# Altium project PCB_Project.PrjPcb
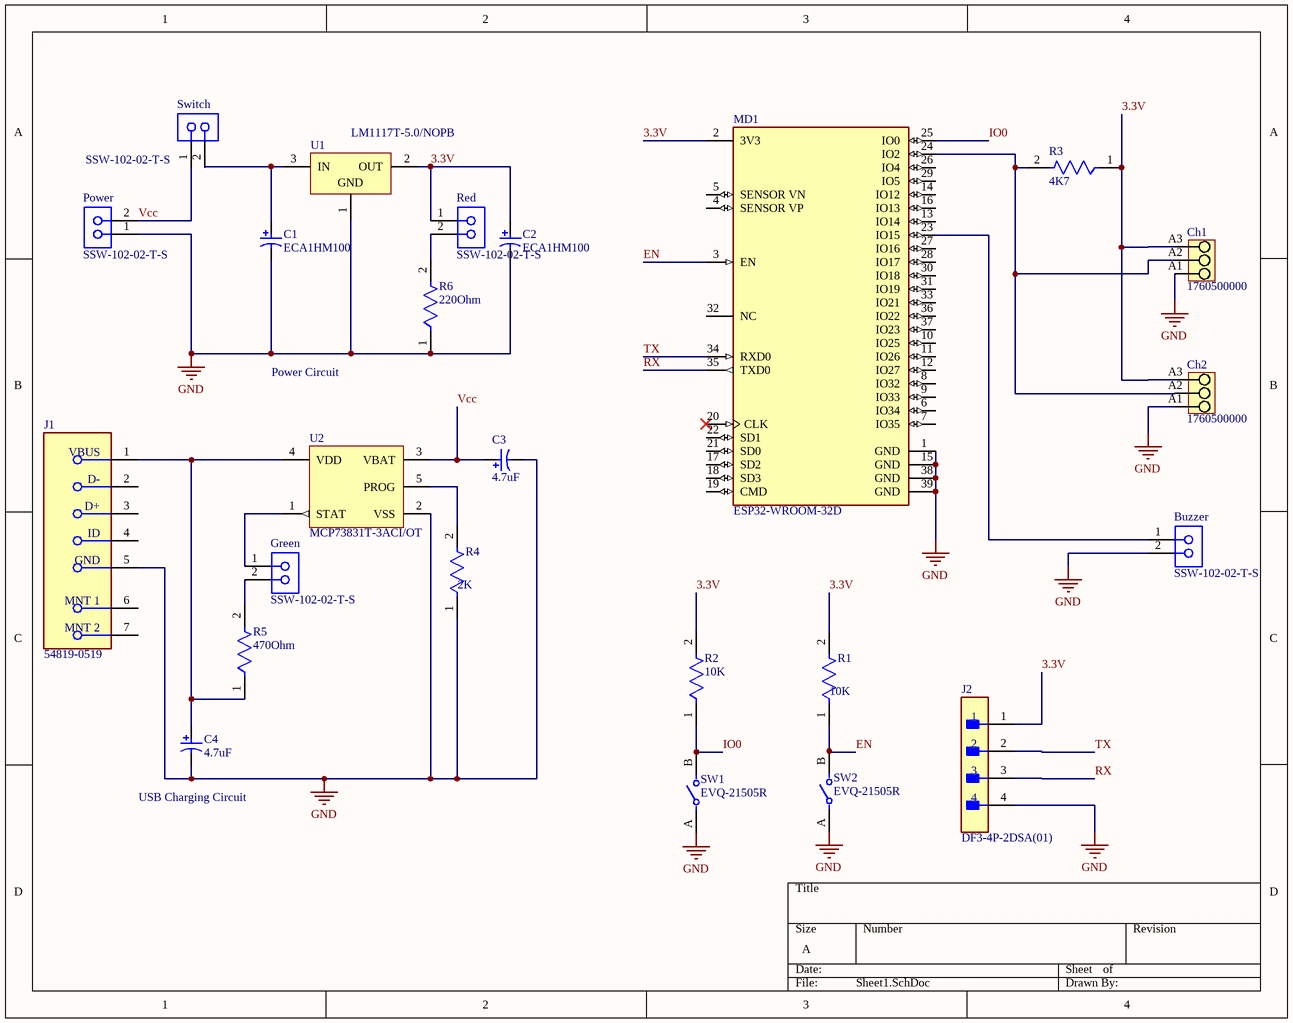
[diagram p0: Sheet1.SchDoc]
1 sheet, 24 parts. Net scope: global (net labels, ports and power ports of the same name join across sheets).
Board file: PCB1.PcbDoc

## Sheet Sheet1.SchDoc
size A; SheetNumber: 1; SheetTotal: 1

### Parts
Buzzer  SSW-102-02-T-S  [SMTC-SSW-102-02-X-S]
C1  ECA1HM100  [CAPPR55-200-1100X500X1200]
C2  ECA1HM100  [CAPPR55-200-1100X500X1200]
C3  4.7uF  [CAPPR55-200-1100X500X1200]
C4  4.7uF  [CAPPR55-200-1100X500X1200]
Ch1  1760500000  [PM_5_08_90_03]
Ch2  1760500000  [PM_5_08_90_03]
Green  SSW-102-02-T-S  [SMTC-SSW-102-02-X-S]
J1  54819-0519  [FP-54819-0519-MFG]
J2  DF3-4P-2DSA(01)  [FP-DF3-4P-2DSA_01-MFG]
MD1  ESP32-WROOM-32D  [FP-ESP32-WROOM-32D-MFG]
Power  SSW-102-02-T-S  [SMTC-SSW-102-02-X-S]
R1  10K  [FP-CF18-MFG]
R2  10K  [FP-CF18-MFG]
R3  4K7  [FP-CF18-MFG]
R4  2K  [FP-CF18-MFG]
R5  470Ohm  [FP-CF18-MFG]
R6  220Ohm  [FP-CF18-MFG]
Red  SSW-102-02-T-S  [SMTC-SSW-102-02-X-S]
SW1  EVQ-21505R  [FP-EVQ-21505R-MFG]
SW2  EVQ-21505R  [FP-EVQ-21505R-MFG]
Switch  SSW-102-02-T-S  [SMTC-SSW-102-02-X-S]
U1  LM1117T-5.0/NOPB  [NDE0003A]
U2  MCP73831T-3ACI/OT  [SOT-23-OT5_M]

### Nets
GND: Buzzer.2 C1.2 C2.2 C3.2 C4.2 Ch1.A1 Ch2.A1 J1.5(GND) J2.4 MD1.1(GND) MD1.15(GND) MD1.38(GND) MD1.39(GND) Power.1 R4.1 R6.1 SW1.A SW2.A U1.1(GND) U2.2(VSS)
3.3V: C2.1 Ch1.A3 Ch2.A3 J2.1 MD1.2(3V3) R1.2 R2.2 R3.1 Red.1 U1.2(OUT)
EN: MD1.3(EN) R1.1 SW2.B
IO0: MD1.25(IO0) R2.1 SW1.B
RX: J2.3 MD1.35(TXD0)
TX: J2.2 MD1.34(RXD0)
Vcc: C3.1 Power.2 Switch.1 U2.3(VBAT)
NetBuzzer_1: Buzzer.1 MD1.23(IO15)
NetC1_1: C1.1 Switch.2 U1.3(IN)
NetC4_1: C4.1 J1.1(VBUS) R5.1 U2.4(VDD)
NetCh1_A2: Ch1.A2 Ch2.A2 MD1.24(IO2) R3.2
NetGreen_1: Green.1 U2.1(STAT)
NetGreen_2: Green.2 R5.2
NetR4_2: R4.2 U2.5(PROG)
NetR6_2: R6.2 Red.2

Not connected (* = marked no-connect by the designer): J1 2(D-) 3(D+) 4(ID) 6(MNT_1) 7(MNT_2); MD1 4(SENSOR_VP) 5(SENSOR_VN) 6(IO34) 7(IO35) 8(IO32) 9(IO33) 10(IO25) 11(IO26) 12(IO27) 13(IO14) 14(IO12) 16(IO13) 17(SD2) 18(SD3) 19(CMD) 20(CLK)* 21(SD0) 22(SD1) 26(IO4) 27(IO16) 28(IO17) 29(IO5) 30(IO18) 31(IO19) 32(NC) 33(IO21) 36(IO22) 37(IO23)

### Notes on the sheet
- Power Circuit
- (near C4) USB Charging Circuit

### Library data of the parts
Buzzer Green Power Red Switch = CMP-1023-00323-1: SQ Post Socket, Through-hole, Vertical, -55 to 105 degC, 2.54 mm Pitch, 2-Pin, Female, RoHS; Manufacturer: Samtec; Pitch: 2.54 mm; ComponentLink3Description: Package Specification; ComponentLink2Description: Datasheet; ComponentLink1Description: Manufacturer URL; PackageVersion: CA, 6/1987; DatasheetVersion: F-214; PackageDescription: Assembly, Socket Strip .016 X .031 Tail; ComponentLink2URL: http://www.samtec.com/documents/webfiles/pdf/SSW_TH.PDF; RoHS: True; ComponentLink3URL: http://www.samtec.com/documents/webfiles/cpdf/SSW-1XX-XX-XXX-X-XX-XXX-XX-MKT.pdf; ComponentLink1URL: http://www.samtec.com; PackageReference: SSW-102-02-X-S; Mounting Technology: Through-hole; Orientation: Vertical; Temperature Range: -55 to 105 degC; PartNumber: SSW-102-02-T-S
C1 C2 = CMP-1665-00038-2: Aluminum Electrolytic Capacitor, 10 uF, +/- 20%, 50 V, -40 to 85 degC, 2-Pin THD, RoHS, Bulk; Manufacturer: Panasonic; Life (Hours): 2000Hour; Lead/Base Style: Straight; Dissipation Factor: 0.12%; Capacitance: 10uF; Leakage Current: 3uA; Dielectric Material: Aluminium; Lead Diameter: 0.5mm; Voltage Rating: 50V; Ripple Current: 65mA; Package Reference: CAPPR55-200-1100X500X1200; Height: 11mm; Diameter: 5mm; REACH SVHC: NoSVHC; Mount: ThroughHole; Packaging: Bulk; Manufacturer URL: http://www.panasonic.com/; Termination: Radial; Datasheet URL: https://industrial.panasonic.com/cdbs/www-data/pdf/RDF0000/ABA0000C1218.pdf; Lead Free: LeadFree; Height - Seated (Max): 0.472inch; Case/Package: Radial; Package Description: 2-Pin Radial Lead, Dia 5 mm, Height 12 mm; Tolerance: 20%; Datasheet Version: Rev. 05, 10/2016; Package Quantity: 200; Ripple Current (AC): 65mA; Min Operating Temperature: -40degC; RoHSCompliant: true; Number of Pins: 2; Max Operating Temperature: 85degC; Voltage: 50V; Lead Pitch: 2mm; Radiation Hardening: No; Voltage Rating (DC): 50V; Length: 11mm
C3 C4 = CMP-1665-00037-2: Aluminum Electrolytic Capacitor, 4.7 uF, +/- 20%, 50 V, -40 to 85 degC, 2-Pin THD, RoHS, Bulk; Manufacturer: Panasonic; Life (Hours): 2000Hour; Dielectric Material: Aluminium; Voltage Rating: 50V; Leakage Current: 3uA; Ripple Current: 45mA; Lead/Base Style: Straight; Dissipation Factor: 0.12%; Lead Diameter: 0.5mm; Package Description: 2-Pin Radial Lead, Dia 5 mm, Height 12 mm; REACH SVHC: NoSVHC; RoHSCompliant: true; Height: 11mm; Package Reference: CAPPR55-200-1100X500X1200; Datasheet URL: https://industrial.panasonic.com/cdbs/www-data/pdf/RDF0000/ABA0000C1218.pdf; Lead Pitch: 2mm; Diameter: 5mm; Voltage Rating (DC): 50V; Voltage: 50V; Termination: Radial; Min Operating Temperature: -40degC; Package Quantity: 200; Max Operating Temperature: 85degC; Length: 11mm; Mount: ThroughHole; Number of Pins: 2; Lead Free: LeadFree; Ripple Current (AC): 45mA; Datasheet Version: Rev. 05, 10/2016; Width: 0inch; Capacitance: 4.7uF; Case/Package: Radial; Tolerance: 20%; Manufacturer URL: http://www.panasonic.com/; Height - Seated (Max): 0.472inch; Packaging: Bulk; Radiation Hardening: No
Ch1 Ch2 = CMP-1559-01629-1: OMNIMATE Signal - series PM; Manufacturer: Weidmueller; Pitch_mm: 5,08 mm; Pitch_inch: 0,2 inch; Wire_cross_section_AWG_min_UL_1059: AWG 26; Contact_surface: tinned; Contact_material: Cu-Leg; Short_text_for_material: PM 5.08/03/90 3.5SN OR BX; Rated_voltage_use_group_B_UL_1059: 300 V; Solid_min_H05_07_V_U: 0,13 mm²; Solder_pin_length_mm: 3,5 mm; Rated_voltage_for_surge_voltage_class_pollution_degree_II_2: 600 V; Mounting_onto_the_PCB: Solder connection; Solid_max_H05_07_V_U: 2,5 mm²; Side_termination_characteristic: closed side; Rated_current_use_group_B_UL_1059: 15 A; Wire_cross_section_AWG_max_UL_1059: AWG 14; Insulating_material: Wemid (PA); UL_94_flammability_rating: V-0; No_of_poles: 3; ComponentLink2Description: URL Link1; ComponentLink1Description: Manufacturer URL; PartNumber: 1760500000; ComponentLink2URL: http://catalog.weidmueller.com/catalog/Start.do?localeId=en&ObjectID=1760500000; ComponentLink1URL: http://www.weidmueller.com/; Qty: 500 PCS; Colour: Orange; Packaging: Box; Revision: V1; PackageReference: PM_5_08_90_03
J1 = CMP-04767-000009-1: CONN RCPT USB2.0 MINI B 5P R/A; Number of Circuits: 5; Max Current Rating: 1A; Pitch: 0.8mm; Contact Resistance: 50mR; Data Rate: 480Mbps; Gender: Receptacle; Number of Ports: 1; Connector Type: USB; Working Voltage: 30V; Insulation Resistance: 100MR; Number of Rows: 1; Series: 54819; USB Standard: USB 2.0; Contact Plating: Gold; Min Operating Temperature: 0°C; Radiation Hardening: No; Current Rating: 1A; Number of Terminals/Pins: 5; Number of Positions: 5; Packaging: Tray; Termination: Solder; Orientation: Right Angle; Flammability Rating: UL94 V-0; Package Quantity: 3600; Number of Contacts: 5; Lead Free: Lead Free; Max Operating Temperature: 50°C; Color: Black; Housing Color: Black; Contact Material: Copper Alloy; Width: 6.9mm; Length: 7.7mm; Housing Material: Polyamide; Features: Shielded; Mount: Through Hole; Voltage Rating: 30V; Depth: 9mm; Voltage Rating (DC): 30V
J2 = CMP-11610-000023-1: CONN HEADER VERT 4POS 2MM; Connector Type: Male Pin; Voltage Rating: 100V; Max Current Rating: 3A; Number of Positions: 4; Gender: Male; Contact Resistance: 30mR; Lead Free: Lead Free; Contact Type: Male Pin; RoHS Compliant: Yes; Pitch: 2mm; Housing Material: Polyamide; Contact Gender: Male; Mount: Through Hole; Series: DF3; Housing Color: Black; Contact Plating: Gold; Package Quantity: 100; Orientation: Straight; Color: Black; Number of Rows: 1; Packaging: Bag; Depth: 5mm; Contact Material: Brass; Height: 5mm; Termination: Press-Fit; Number of Contacts: 4; Current Rating: 3A; Max Operating Temperature: 85°C; REACH SVHC: No SVHC; Length: 10mm; Min Operating Temperature: -30°C; Max Voltage Rating (AC): 100V
MD1 = CMP-194065-000003-1: WIFI MODULE 32MBITS SPI FLASH; Manufacturer: Espressif Systems; Max Supply Voltage: 3.6V; Nominal Supply Current: 500mA; Max Frequency: 2484MHz; Number Of Adc Channels: 16; Number Of Gpio: 32; Interface: I2C,SPI,UART,Ethernet,I2S,Other; Data Rate: 150Mbits/s; Min Supply Voltage: 3V; Bandwidth: 72MHz; Sensitivity: -98dBm; Octopart: https://octopart.com/esp32-wroom-32d-espressif+systems-91040050; Package: ESP32-WROOM-32D; ComponentLink2URL: https://www.espressif.com/sites/default/files/documentation/esp32-wroom-32d_esp32-wroom-32u_datasheet_en.pdf; Lead Free: Yes; Category: UNK; Mouser Description: Wi-Fi/BT BLE Module ESP32-D0WD, SPI Flash, UART, P; Device Class L1: Integrated Circuits (ICs); RoHS: TRUE; Temperature Range Low: -40°C; ComponentLink2Description: Datasheet; Digikey Description: WIFI MODULE 32MBITS SPI FLASH; Height: 3.2mm; Temperature: -40°C to +85°C; Manufacturer Part Number: ESP32-WROOM-32D; Device Class L3: Transceivers; Device Class L2: RF Semiconductors and Devices; Temperature Range High: +85°C; Automotive: No
R1-R6 = CMP-26528-000002-1: RES 10K OHM 1/8W 5% CF AXIAL; Manufacturer Part Number: CF18JT10K0; Manufacturer: Stackpole Electronics; Power Rating: 0.125W; Temperature Coefficient: 0-500ppm/°C; Resistance: 10kΩ; Voltage Rating: 250V; Value: 10kΩ; Temperature: -55°C to +155°C; Height: 2mm; Lead Free: Yes; Automotive: No; Device Class L2: Resistors; Package: CF18; Series: CF; ComponentLink2Description: Datasheet; Ipc Land Pattern Name: RESAD656W65L360D200; Temperature Range High: +155°C; RoHS: TRUE; Device Class L3: Through-Hole Resistors; Temperature Range Low: -55°C; Device Class L1: Passive Components; Category: Res; Octopart: https://octopart.com/cf18jt10k0-stackpole+electronics-19205642; Composition: Carbon Film; Digikey Description: RES 10K OHM 1/8W 5% CF AXIAL; ComponentLink2URL: http://www.seielect.com/Catalog/SEI-CF_CFM.pdf; Tolerance: 5%
SW1 SW2 = CMP-05618-000118-1: SWITCH TACTILE SPST-NO 0.02A 15V; Actuator Length: 1.6mm; Contact Current Rating: 20mA; Actuator Type: Standard; Operating Force: 1.6N; Switch Function: Off-Mom; Mechanical Life: 100000Cycles; Illumination Type: Non-Illuminated; Contact Resistance: 50mR; Actuator Color: Red; Throw Configuration: SPST; Switch Travel: 0.25mm; Termination: PC Pin; Package Quantity: 1; Lead Free: Lead Free; Orientation: Straight; Packaging: Tape and Reel; Series: EVQ2; Min Operating Temperature: -20°C; Max Operating Temperature: 70°C; Width: 6mm; Voltage Rating (DC): 15V; Current Rating: 20mA; Depth: 6mm; Height: 5mm; Contact Plating: Silver; Electrical Life: 100000Cycles; Mount: Through Hole; Max Voltage Rating (DC): 15V; Max Current Rating: 20mA; Length: 6mm; Size: 6mm; Case/Package: Radial
U1 = CMP-0062-02493-3: 800mA Low-Dropout Linear Regulator, 3-pin TO-220, Pb-Free; Manufacturer: Texas Instruments; CompType: LDO IC; PowerWise: N; PackageTopMarking: NSUZXYTTE#*LM1117T*5.0; PinCount: 3; ComponentLink1Description: Datasheet URL; ComponentLink1URL: http://www.ti.com/general/docs/lit/getliterature.tsp?genericPartNumber=LM1117-N&fileType=pdf; RoHS: Y; PackageDescription: TO-220, Molded, 3 Lead, Straight; PackageReference: NDE0003A
U2 = CMP-0133-00145-1: Miniature Single-Cell, Fully Integrated Li-Ion, Li-Polymer Charge Management Controller, 4.35V, 5-Pin SOT-23, Industrial Temperature, Tape and Reel; DatasheetVersion: revE, Sep-2008; PackageVersion: revBB, Aug-2009; Code_IPC: SOT23-5; PackageDescription: 5-Lead Plastic Small Outline Transistor (OT) [SOT-23]; PackageReference: SOT-23-OT5